# Altium schematic sheet [10]-MODEM_CONNECTORS.SchDoc
size A4
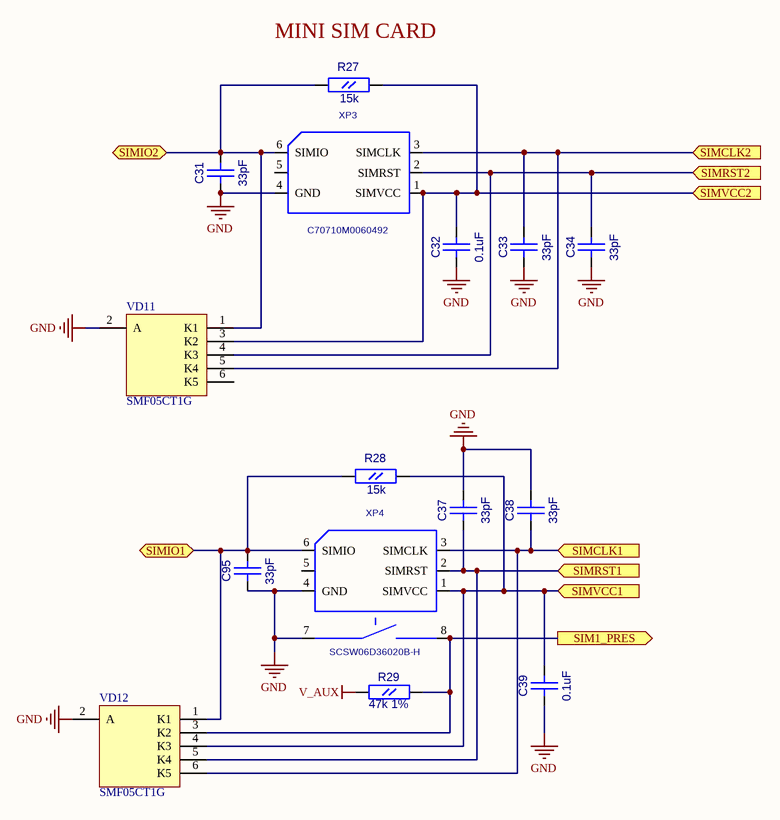
[diagram p0: [10]-MODEM_CONNECTORS.SchDoc]

## Parts
C31  33pF  [CC0603]
C32  0.1uF  [CC0603]
C33  33pF  [CC0603]
C34  33pF  [CC0603]
C37  33pF  [CC0603]
C38  33pF  [CC0603]
C39  0.1uF  [CC0603]
C95  33pF  [CC0603]
R27  15k  [RC0603]
R28  15k  [RC0603]
R29  47k 1%  [RC0603]
VD11  SMF05CT1G  [SOT-363]
VD12  SMF05CT1G  [SOT-363]
XP3  C70710M0060492  [SCVW06A25020]
XP4  SCSW06D36020B-H  [SCSW06D36020B-H]

## Ports
SIM1_PRES (out), SIMCLK1 (in), SIMCLK2 (in), SIMIO1 (bidir), SIMIO2 (bidir), SIMRST1 (in), SIMRST2 (in), SIMVCC1 (in), SIMVCC2 (in)

## Nets
GND: C31.1(A) C32.1(A) C33.1(A) C34.1(A) C37.2(B) C38.2(B) C39.1(A) C95.1(A) VD11.2(A) VD12.2(A) XP3.4(GND) XP4.4(GND) XP4.7
V_AUX: R29.1(A)
SIM1_PRES: R29.2(B) VD12.3(K2) XP4.8 ; port SIM1_PRES
SIMCLK1: C38.1(A) VD12.6(K5) XP4.3(SIMCLK) ; port SIMCLK1
SIMCLK2: C33.2(B) VD11.5(K4) XP3.3(SIMCLK) ; port SIMCLK2
SIMIO1: C95.2(B) R28.1(A) VD12.1(K1) XP4.6(SIMIO) ; port SIMIO1
SIMIO2: C31.2(B) R27.1(A) VD11.1(K1) XP3.6(SIMIO) ; port SIMIO2
SIMRST1: C37.1(A) VD12.5(K4) XP4.2(SIMRST) ; port SIMRST1
SIMRST2: C34.2(B) VD11.4(K3) XP3.2(SIMRST) ; port SIMRST2
SIMVCC1: C39.2(B) R28.2(B) VD12.4(K3) XP4.1(SIMVCC) ; port SIMVCC1
SIMVCC2: C32.2(B) R27.2(B) VD11.3(K2) XP3.1(SIMVCC) ; port SIMVCC2

Not connected (* = marked no-connect by the designer): VD11 6(K5); XP3 5; XP4 5

## Notes on the sheet
- (near R27) MINI SIM CARD

## Library data of the parts
C31-C34 C37-C39 C95 = CC0603
  C31 C33 C34 C37 C38 C95: Value: 33pF
  C32 C39: Value: 0.1uF
R27-R29 = RC0603
  R27 R28: Value: 15k
  R29: Value: 47k 1%
VD11 VD12 = SMF05CT1G: 5-Line Transient Voltage Suppressor Array, 6-Pin SC70, Pb-Free, Tape and Reel; Manufacturer: On Semiconductor; Direction: Unidirectional; IR Max (uA): 5; PPK Max (W): 100; DatasheetVersion: Rev. 4; PackageVersion: Rev. W; PackageReference: SC70-6-419B-02_W; PackageDescription: 6-Pin Small Outline Transistor, Body 2 x 1.25 mm, Pitch 0.65 mm; Supplier 1: Digi-Key; Supplier Part Number 1: SMF05CT1GOSTR-ND; Supplier 2: Digi-Key; Supplier Part Number 2: SMF05CT1GOSCT-ND; Supplier 3: Digi-Key; Supplier Part Number 3: SMF05CT1GOSDKR-ND; Supplier 4: Farnell; Supplier Part Number 4: 1861239; Supplier 5: Newark; Supplier Part Number 5: 10M5715; Supplier 6: Newark; Supplier Part Number 6: 42K2614; Supplier 7: Mouser; Supplier Part Number 7: 863-SMF05CT1G; Packing: Tape and Reel; RoHS: Pb-Free; Mounting Technology: Surface Mount; PartNumber: SMF05CT1G; ComponentLink2Description: Datasheet
XP3 = SCV-W06A25-020: Value: *
XP4 = SCSW06D36020B-H: Value: *